# EAGLE design tech_safari_data_logger (EAGLE 8.6.0)
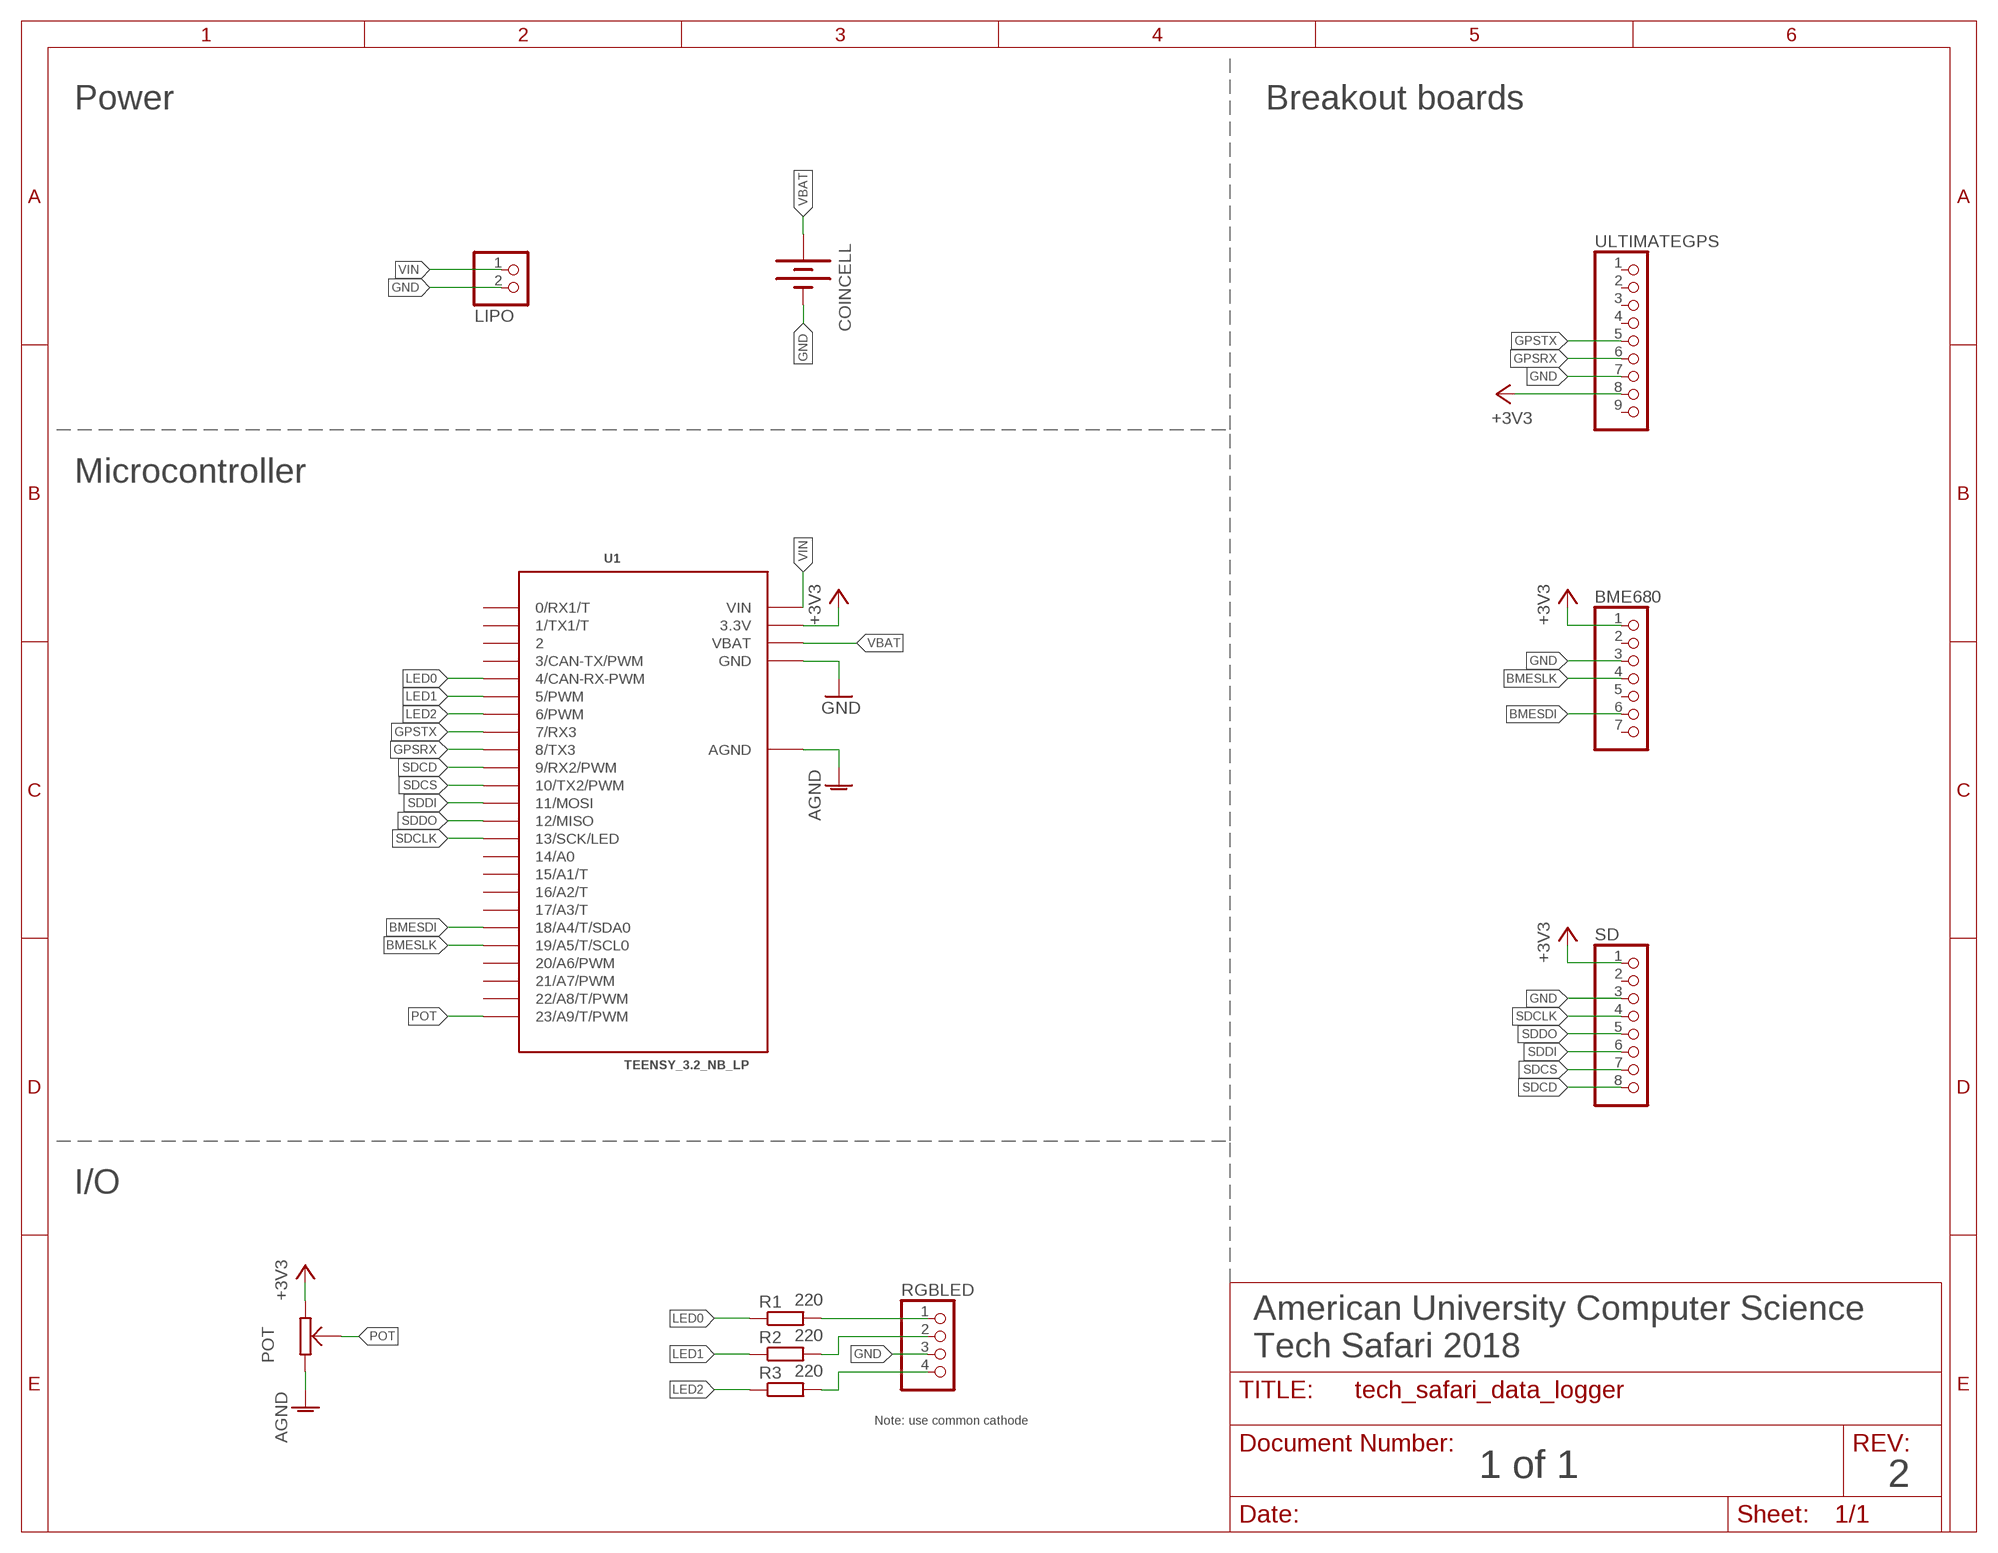
[diagram p0: schematic, sheet 1]

## Parts
BME680  PINHD-1X7  [1X07]
COINCELL  BATTERY  [BATTCON_20MM_SMALL]
LIPO  JST_2PIN-THM-RA  [JST-PH-2-THM-RA]
POT  POTENTIOMETER_THRU  [POTENTIOMETER_THRU]
R1  220  R-EU_0207/10  [0207/10]
R2  220  R-EU_0207/10  [0207/10]
R3  220  R-EU_0207/10  [0207/10]
RGBLED  PINHD-1X4  [1X04]
SD  PINHD-1X8  [1X08]
U1  TEENSY_3.2_NB_LP  [TEENSY_3.2__NB_LP]
ULTIMATEGPS  PINHD-1X9  [1X09]

## Nets
+3V3: BME680.1 POT.3 SD.1 U1.3.3V ULTIMATEGPS.8
AGND: POT.1 U1.AGND
BMESDI: BME680.6 U1.18/A4(18/A4/T/SDA0)
BMESLK: BME680.4 U1.19/A5(19/A5/T/SCL0)
GND: BME680.3 COINCELL.NEG(-) LIPO.2 RGBLED.3 SD.3 U1.GND ULTIMATEGPS.7
GPSRX: U1.8(8/TX3) ULTIMATEGPS.6
GPSTX: U1.7(7/RX3) ULTIMATEGPS.5
LED0: R1.1 U1.4(4/CAN-RX-PWM)
LED1: R2.1 U1.5(5/PWM)
LED2: R3.1 U1.6(6/PWM)
N$5: R1.2 RGBLED.1
N$6: R2.2 RGBLED.2
N$7: R3.2 RGBLED.4
POT: POT.2 U1.23/A9(23/A9/T/PWM)
SDCD: SD.8 U1.9(9/RX2/PWM)
SDCLK: SD.4 U1.13(13/SCK/LED)
SDCS: SD.7 U1.10(10/TX2/PWM)
SDDI: SD.6 U1.11(11/MOSI)
SDDO: SD.5 U1.12(12/MISO)
VBAT: COINCELL.1(+) COINCELL.2(+) COINCELL.3(+) COINCELL.4(+) U1.VBAT
VIN: LIPO.1 U1.VIN
Unconnected: BME680.2 BME680.5 BME680.7 SD.2 U1.0(0/RX1/T) U1.1(1/TX1/T) U1.2 U1.3(3/CAN-TX/PWM) U1.14/A0 U1.15/A1(15/A1/T) U1.16/A2(16/A2/T) U1.17/A3(17/A3/T) U1.20/A6(20/A6/PWM) U1.21/A7(21/A7/PWM) U1.22/A8(22/A8/T/PWM) ULTIMATEGPS.1 ULTIMATEGPS.2 ULTIMATEGPS.3 ULTIMATEGPS.4 ULTIMATEGPS.9

## Notes on the sheet
- Power | Breakout boards
- Microcontroller
- I/O
- American University Computer Science
  Tech Safari 2018
- Note: use common cathode
- 1 of 1 | 2

## Library data of the parts
BME680 = pinhead:PINHD-1X7: PIN HEADER
COINCELL = personal:BATTERY: Battery Holders Various common sizes : AA, AAA, 18650 (PRT-12895), 20mm coin cell and 12mm coin cell. 20MM_4LEGS, BATT-10373
LIPO = adafruit:JST_2PIN: JST 2-Pin Connectors of various flavors SMT-RA (S2B-PH-SM4) 4UConnector #17311 SMT (B2B-PH-SM4) THM-RA (S2B-PH) THM (B2B-PH)
POT = personal:POTENTIOMETER_THRU
R1-R3 = rcl:R-EU_: RESISTOR, European symbol; SPICEPREFIX: R
RGBLED = pinhead:PINHD-1X4: PIN HEADER
SD = pinhead:PINHD-1X8: PIN HEADER
U1 = personal:TEENSY_3.2_NB_LP: Footprint for Teensy 3.1 board using all pin connections on the outer perimeter
ULTIMATEGPS = pinhead:PINHD-1X9: PIN HEADER

## Board
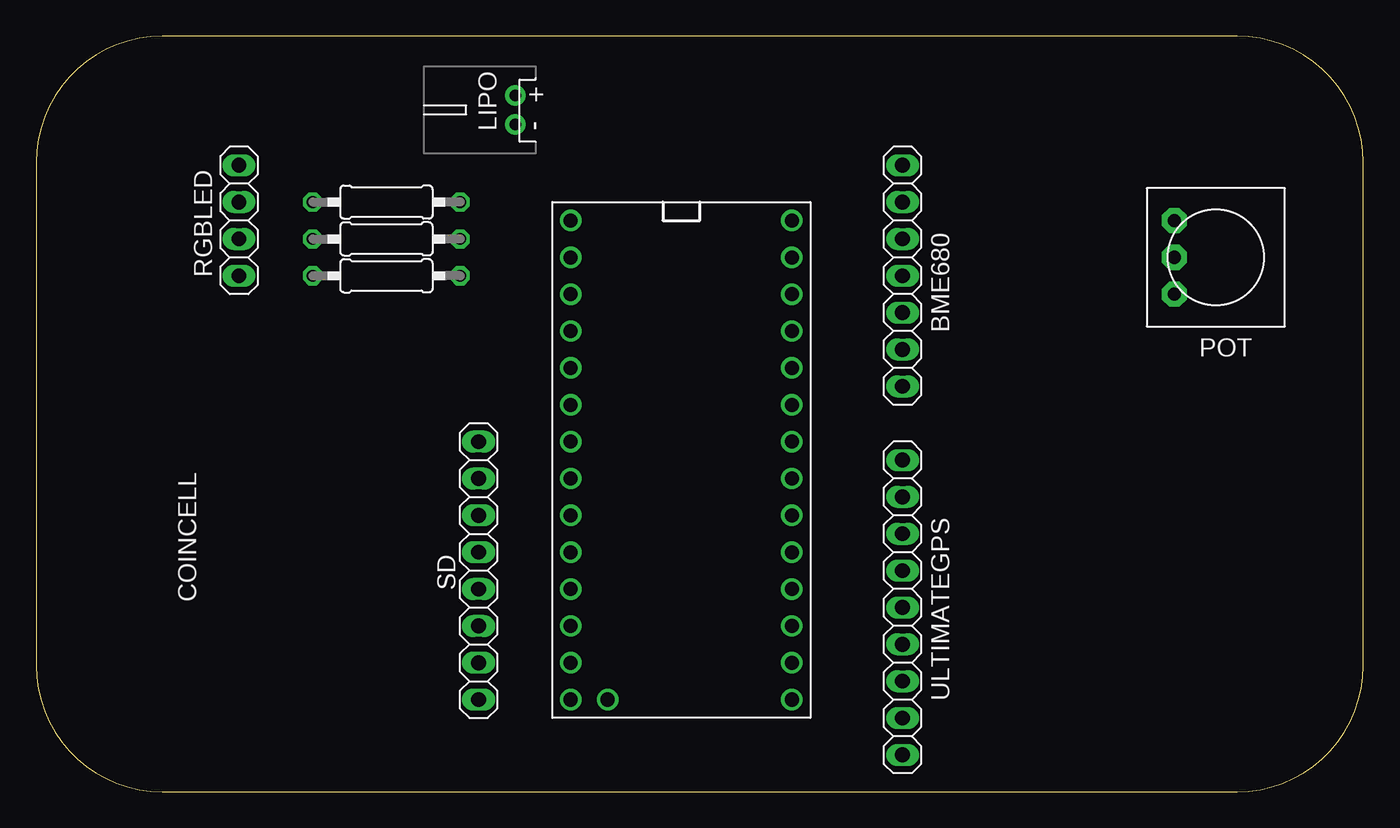
[diagram p1: board, top side]
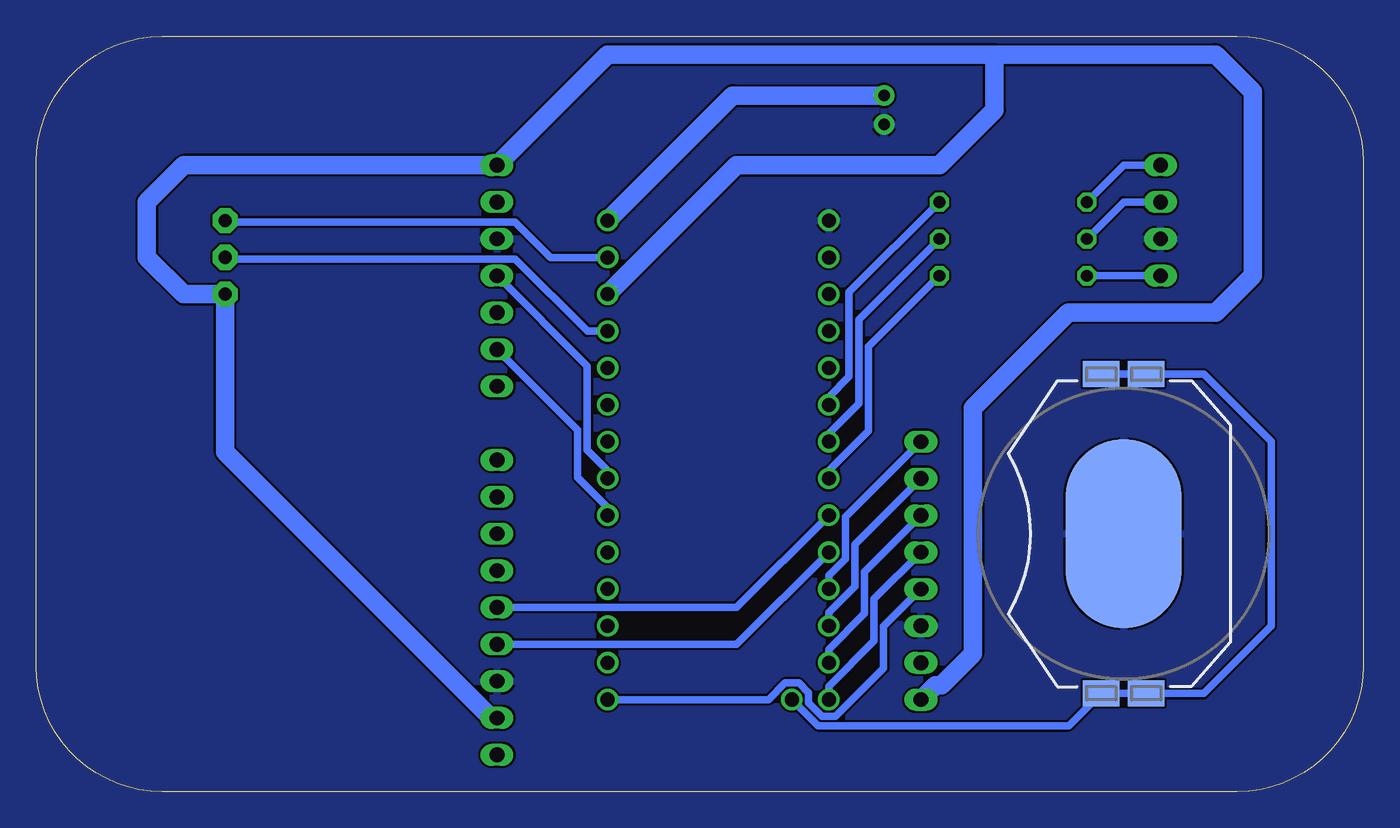
[diagram p2: board, bottom side, seen from below]

Size 91.44 x 52.07 mm. Coordinates in mm from the lower left corner, seen from the top.
Outline: 82.77,52.07 8.67,52.07 arc90 0,43.4 0,8.67 arc90 8.67,0 82.77,0 arc90 91.44,8.67 91.44,43.4 arc90 82.77,52.07
Copper layers (1*16): Top 0.035mm / dielectric 1.5mm / Bottom 0.035mm
Design rules "OthermillDRC_30_deg_v2": minimum track width 6mil, minimum drill 0.8mm, track to track 6mil, track to pad 6mil, pad to pad 6mil, via to via 6mil, smd to smd 0mil, copper to edge 0mil, drill to drill 6mil, minimum pad ring 10mil, minimum via ring 10mil, stop-mask expansion 1mil, vias tented up to drill 30mil, thermal gap 6mil

### Footprints (pad centres in the part's own frame; a part is rotated, then mirrored left to right if it is on the bottom)
1X07 = drill 1.016 long: 1 -7.62,0; 2 -5.08,0; 3 -2.54,0; 4 0,0; 5 2.54,0; 6 5.08,0; 7 7.62,0
BATTCON_20MM_SMALL = smd 1.778 x 2.54: 1 -11,1.55; 2 -11,-1.55; 3 11,1.55; 4 11,-1.55 | smd 13 x 8: NEG 0,0
JST-PH-2-THM-RA = drill 0.8 pad 1.422: 1 1,0; 2 -1,0
POTENTIOMETER_THRU = drill 0.9 pad 1.727 octagon: 1 -2.54,-2.857; 2 0,-2.857; 3 2.54,-2.857
0207/10 = drill 0.813 octagon: 1 -5.08,0; 2 5.08,0
1X04 = drill 1.016 long: 1 -3.81,0; 2 -1.27,0; 3 1.27,0; 4 3.81,0
1X08 = drill 1.016 long: 1 -8.89,0; 2 -6.35,0; 3 -3.81,0; 4 -1.27,0; 5 1.27,0; 6 3.81,0; 7 6.35,0; 8 8.89,0
TEENSY_3.2__NB_LP = drill 0.965: 0 -7.62,13.97; 1 -7.62,11.43; 2 -7.62,8.89; 3 -7.62,6.35; 3.3V 7.62,11.43; 4 -7.62,3.81; 5 -7.62,1.27; 6 -7.62,-1.27; 7 -7.62,-3.81; 8 -7.62,-6.35; 9 -7.62,-8.89; 10 -7.62,-11.43; 11 -7.62,-13.97; 12 -7.62,-16.51; 13 7.62,-16.51; 14/A0 7.62,-13.97; 15/A1 7.62,-11.43; 16/A2 7.62,-8.89; 17/A3 7.62,-6.35; 18/A4 7.62,-3.81; 19/A5 7.62,-1.27; 20/A6 7.62,1.27; 21/A7 7.62,3.81; 22/A8 7.62,6.35; 23/A9 7.62,8.89; AGND 7.62,13.97; GND -7.62,16.51; VBAT -5.08,-16.51; VIN 7.62,16.51
1X09 = drill 1.016 long: 1 -10.16,0; 2 -7.62,0; 3 -5.08,0; 4 -2.54,0; 5 0,0; 6 2.54,0; 7 5.08,0; 8 7.62,0; 9 10.16,0

### Placement (x,y rotation side)
BME680  59.69,35.56 270 top
COINCELL  16.51,17.78 270 bottom
LIPO  33.02,46.99 90 top
POT  81.28,36.83 270 top
R1  24.13,40.64 180 top
R2  24.13,38.1 180 top
R3  24.13,35.56 180 top
RGBLED  13.97,39.37 270 top
SD  30.48,15.24 90 top
U1  44.45,22.86 0 top
ULTIMATEGPS  59.69,12.7 270 top

### Tracks (layer width: path | path; a pad name or v marks a point on that pad's centre or on a via)
+3V3
  Bottom 1.27: 25.4,50.8 52.07,50.8 BME680.1 81.28,43.18 83.82,40.64 83.82,36.83 81.28,34.29 POT.3 78.42,23.4 60.1,5.08 ULTIMATEGPS.8 | U1.3.3V 43.18,43.18 29.21,43.18 25.4,46.99 25.4,50.8 | 25.4,50.8 10.16,50.8 7.62,48.26 7.62,35.56 10.16,33.02 20.32,33.02 26.9,26.44 26.9,9.52 29.08,7.34 29.49,7.34 SD.1
AGND
  Bottom 0.508: U1.AGND 56.01,36.83 58.44,39.27 78.32,39.27 POT.1
BMESDI
  Bottom 0.508: BME680.6 54.14,24.93 54.14,21.67 52.07,19.6 U1.18/A4
BMESLK
  Bottom 0.508: BME680.4 53.48,29.35 53.48,23.55 52.07,22.14 U1.19/A5
GND
  pour Bottom: -2.54,54.61 93.98,54.61 93.98,-2.54 -2.54,-2.54
GPSRX
  Bottom 0.508: U1.8 43.18,10.16 ULTIMATEGPS.6
GPSTX
  Bottom 0.508: U1.7 43.18,12.7 ULTIMATEGPS.5
LED0
  Bottom 0.508: R1.1 35.42,34.43 35.42,28.63 36.83,27.22 U1.4
LED1
  Bottom 0.508: R2.1 34.76,32.55 34.76,26.75 36.83,24.68 U1.5
LED2
  Bottom 0.508: R3.1 34.1,30.67 34.1,24.87 36.83,22.14 U1.6
N$5
  Bottom 0.508: R1.2 16.51,43.18 RGBLED.1
N$6
  Bottom 0.508: R2.2 16.51,40.64 RGBLED.2
N$7
  Bottom 0.508: R3.2 RGBLED.4
POT
  Bottom 0.508: U1.23/A9 53.47,31.75 58.44,36.73 78.32,36.73 POT.2
SDCD
  Bottom 0.508: SD.8 35.69,18.92 35.69,16.04 36.83,14.89 U1.9
SDCLK
  Bottom 0.508: SD.4 33.05,11.4 33.05,8.52 36.36,5.21 37.3,5.21 38.23,6.13 38.23,6.82 38.9,7.49 39.84,7.49 40.99,6.35 U1.13
SDCS
  Bottom 0.508: SD.7 35.03,17.04 35.03,14.16 36.83,12.35 U1.10
SDDI
  Bottom 0.508: SD.6 34.37,15.16 34.37,12.28 36.83,9.81 U1.11
SDDO
  Bottom 0.508: SD.5 33.71,13.28 33.71,10.4 36.83,7.27 U1.12
VBAT
  Bottom 0.508: COINCELL.2 COINCELL.1 11,28.78 6.35,24.13 6.35,11.43 11,6.78 COINCELL.3 COINCELL.4 20.29,4.55 37.58,4.55 38.89,5.86 38.89,5.87 U1.VBAT
VIN
  Bottom 1.27: U1.VIN 43.45,47.99 LIPO.1

### Text on the board
Document: Tech Safari Data Logger | Note: run wire from Coin+ to Vbat on Teensy